# Altium project DriverBoard.PrjPCB
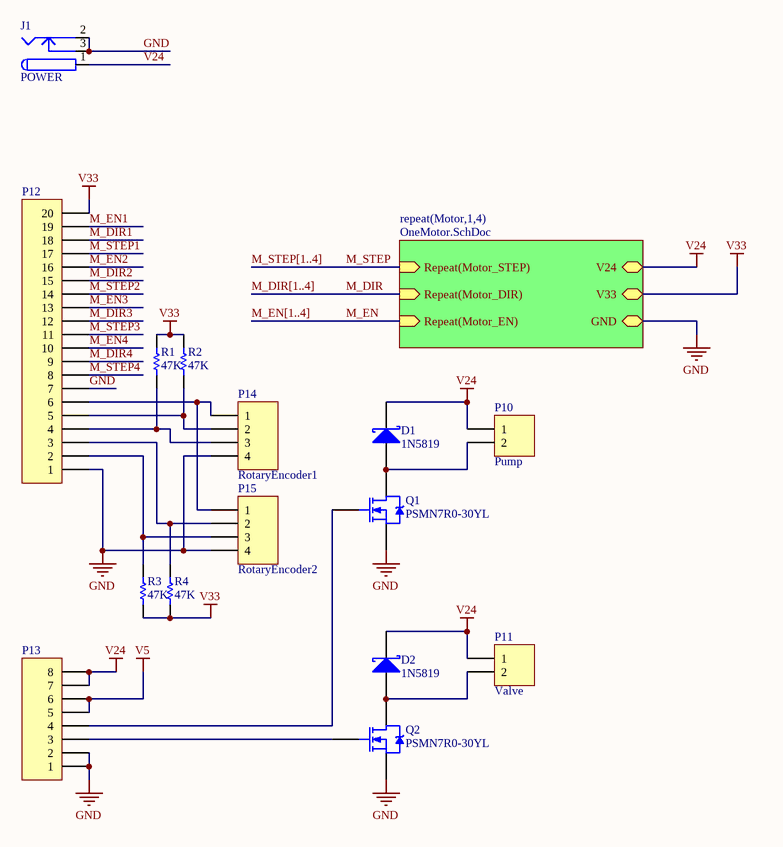
[diagram p0: DriverBoard.SchDoc]
2 sheets, 83 parts. Net scope: hierarchical (ports join the sheet entries above them; power ports are global).
Board file: DriverBoard.PcbDoc
Sheets:
  DriverBoard.SchDoc
    Motor1 = OneMotor.SchDoc
    Motor2 = OneMotor.SchDoc
    Motor3 = OneMotor.SchDoc
    Motor4 = OneMotor.SchDoc

## Sheet DriverBoard.SchDoc
size A4; Author: Zhang YuXiang; DrawnBy: Zhang YuXiang

### Parts
D1  1N5819  [DO-214AC]
D2  1N5819  [DO-214AC]
J1  POWER  [DC_POWER]
P10  Pump  [HDR1X2H]
P11  Valve  [HDR1X2H]
P12  Header 20  [HDR1X20]  (value not drawn)
P13  Header 8  [HDR1X8]  (value not drawn)
P14  RotaryEncoder1  [HDR1X4H]
P15  RotaryEncoder2  [HDR1X4H]
Q1  PSMN7R0-30YL  [SOT669]
Q2  PSMN7R0-30YL  [SOT669]
R1  value 47K  [R-1608[0603]]  (hidden comment: Res Semi)
R2  value 47K  [R-1608[0603]]  (hidden comment: Res Semi)
R3  value 47K  [R-1608[0603]]  (hidden comment: Res Semi)
R4  value 47K  [R-1608[0603]]  (hidden comment: Res Semi)

### Sub-sheets
repeat(Motor,1,4) = OneMotor.SchDoc: Repeat(Motor_STEP) (in), Repeat(Motor_DIR) (in), Repeat(Motor_EN) (in), V24, V33, GND

### Nets
GND: J1.2 J1.3 P12.1 P12.7 P13.1 P13.2 P14.4 P15.4 Q1.3(S) Q2.3(S) ; sheet repeat(Motor,1,4)/GND
V5: P13.5 P13.6
V24: D1.2(K) D2.2(K) J1.1 P10.1 P11.1 P13.7 P13.8 ; sheet repeat(Motor,1,4)/V24
V33: P12.20 R1.2 R2.2 R3.1 R4.1 ; sheet repeat(Motor,1,4)/V33
M_DIR: sheet repeat(Motor,1,4)/Repeat(Motor_DIR)
M_DIR1: P12.18  [project net FR]
M_DIR2: P12.15  [project net FR]
M_DIR3: P12.12  [project net FR]
M_DIR4: P12.9  [project net FR]
M_EN: sheet repeat(Motor,1,4)/Repeat(Motor_EN)
M_EN1: P12.19  [project net EN]
M_EN2: P12.16  [project net EN]
M_EN3: P12.13  [project net EN]
M_EN4: P12.10  [project net EN]
M_STEP: sheet repeat(Motor,1,4)/Repeat(Motor_STEP)
M_STEP1: P12.17
M_STEP2: P12.14
M_STEP3: P12.11
M_STEP4: P12.8
NetD1_1: D1.1(A) P10.2 Q1.2(D)
NetD2_1: D2.1(A) P11.2 Q2.2(D)
NetP12_2: P12.2 P15.3 R3.2
NetP12_3: P12.3 P15.2 R4.2
NetP12_4: P12.4 P14.3 R1.1
NetP12_5: P12.5 P14.2 R2.1
NetP12_6: P12.6 P14.1 P15.1
NetP13_3: P13.3 Q2.1(G)
NetP13_4: P13.4 Q1.1(G)

### Buses and harness runs
bus M_DIR[1..4]
bus M_EN[1..4]
bus M_STEP[1..4]

### Library data of the parts
D1 D2 = D Schottky: Schottky Diode; Published: 8-Jun-2000; LatestRevisionDate: 17-Jul-2002; LatestRevisionNote: Re-released for DXP Platform.; PackageReference: SMB; Publisher: Altium Limited; Code_JEDEC: DO-214-AA
J1 = POWER2.5
P10 P11 = Header 2H: Header, 2-Pin, Right Angle; LatestRevisionDate: 17-Jul-2002; LatestRevisionNote: Re-released for DXP Platform.; Publisher: Altium Limited
P12 = Header 20: Header, 20-Pin; LatestRevisionDate: 17-Jul-2002; LatestRevisionNote: Re-released for DXP Platform.; Publisher: Altium Limited
P13 = Header 8: Header, 8-Pin; LatestRevisionDate: 17-Jul-2002; LatestRevisionNote: Re-released for DXP Platform.; Publisher: Altium Limited
P14 P15 = Header 4H: Header, 4-Pin, Right Angle; LatestRevisionDate: 17-Jul-2002; LatestRevisionNote: Re-released for DXP Platform.; Publisher: Altium Limited
Q1 Q2 = NMOS-2: N-Channel Power MOSFET; Note: Pin 2 is electrically connected to pin 4.; Published: 8-Jun-2000; LatestRevisionDate: 17-Jul-2002; LatestRevisionNote: Re-released for DXP Platform.; DatasheetDocument: PD-9.814; PackageReference: TO-220AB; Publisher: Altium Limited; Code_JEDEC: TO-220-AB; ComponentLink1Description: Manufacturer Link; ComponentLink1URL: http://www.irf.com/
R1-R4 = Res Semi: Semiconductor Resistor; Published: 8-Jun-2000; LatestRevisionDate: 17-Jul-2002; LatestRevisionNote: Re-released for DXP Platform.; PackageReference: AXIAL-0.5; Publisher: Altium Limited

## Sheet OneMotor.SchDoc
size A4; Author: Zhang YuXiang; DrawnBy: Zhang YuXiang; Engineer: Zhang YuXiang
Used 4 times, as channels Motor1, Motor2, Motor3, Motor4. Parts and nets are listed once, with the designators drawn on the sheet.
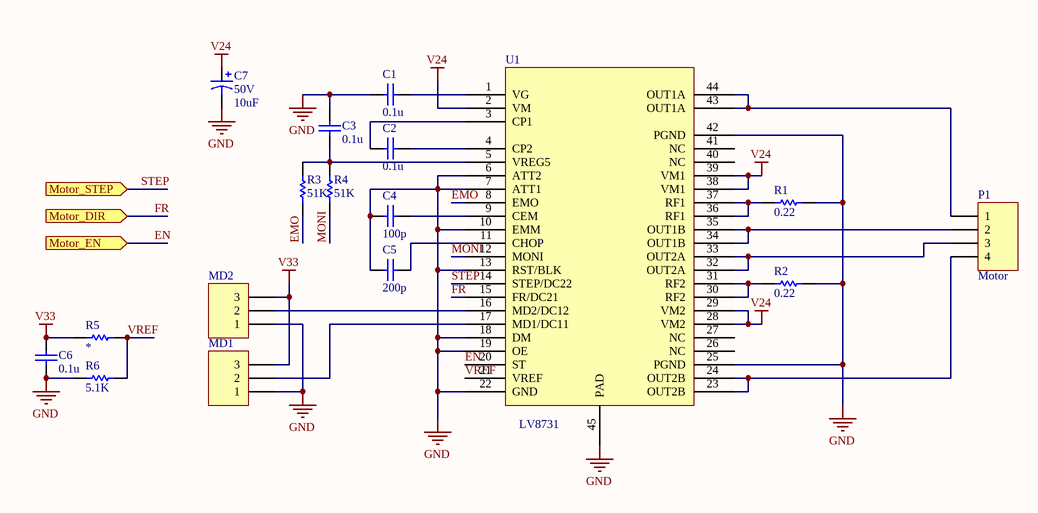
[diagram p1: OneMotor.SchDoc]

### Parts
C1  value 0.1u  [C-1608[0603]]  (hidden comment: Cap Semi)
C2  value 0.1u  [C-1608[0603]]  (hidden comment: Cap Semi)
C3  value 0.1u  [C-1608[0603]]  (hidden comment: Cap Semi)
C4  value 100p  [C-1608[0603]]  (hidden comment: Cap Semi)
C5  value 200p  [C-1608[0603]]  (hidden comment: Cap Semi)
C6  value 0.1u  [C-1608[0603]]  (hidden comment: Cap Semi)
C7  50V  value 10uF  [RB.1/.25]
MD1  Header 3  [shortPad]  (value not drawn)
MD2  Header 3  [shortPad]  (value not drawn)
P1  Motor  [HDR1X4]
R1  value 0.22  [R-6332[2512]]  (hidden comment: Res Semi)
R2  value 0.22  [R-6332[2512]]  (hidden comment: Res Semi)
R3  value 51K  [R-1608[0603]]  (hidden comment: Res Semi)
R4  value 51K  [R-1608[0603]]  (hidden comment: Res Semi)
R5  Res Semi  [R-1608[0603]]  (value not drawn)
R6  value 5.1K  [R-1608[0603]]  (hidden comment: Res Semi)
U1  LV8731  [LV8731_V3]

### Ports
Motor_DIR (in), Motor_EN (in), Motor_STEP (in)

### Nets
GND: C1.2 C3.1 C4.1 C5.1 C6.1 C7.2 MD1.1 MD2.1 R1.1 R2.1 R6.1 U1.6(ATT2) U1.7(ATT1) U1.10(EMM) U1.13(RST/BLK) U1.18(DM) U1.19(OE) U1.22(GND) U1.25(PGND) U1.42(PGND) U1.45(PAD)
V24: C7.1 U1.2(VM) U1.28(VM2) U1.29(VM2) U1.38(VM1) U1.39(VM1)
V33: C6.2 MD1.3 MD2.3 R5.1
EMO: R3.1 U1.8(EMO)
EN: U1.20(ST) ; port Motor_EN
FR: U1.15(FR/DC21) ; port Motor_DIR
MONI: R4.1 U1.12(MONI)
STEP: U1.14(STEP/DC22) ; port Motor_STEP
VREF: R5.2 R6.2 U1.21(VREF)
NetC1_1: C1.1 U1.1(VG)
NetC2_1: C2.1 U1.4(CP2)
NetC2_2: C2.2 U1.3(CP1)
NetC3_2: C3.2 R3.2 R4.2 U1.5(VREG5)
NetC4_2: C4.2 U1.9(CEM)
NetC5_2: C5.2 U1.11(CHOP)
NetMD1_2: MD1.2 U1.17(MD1/DC11)
NetMD2_2: MD2.2 U1.16(MD2/DC12)
NetP1_1: P1.1 U1.43(OUT1A) U1.44(OUT1A)
NetP1_2: P1.2 U1.34(OUT1B) U1.35(OUT1B)
NetP1_3: P1.3 U1.32(OUT2A) U1.33(OUT2A)
NetP1_4: P1.4 U1.23(OUT2B) U1.24(OUT2B)
NetR1_2: R1.2 U1.36(RF1) U1.37(RF1)
NetR2_2: R2.2 U1.30(RF2) U1.31(RF2)

Not connected (* = marked no-connect by the designer): U1 26(NC) 27(NC) 40(NC) 41(NC)

### Channels
Motor1: designators end in _1; ports Motor_DIR=FR Motor_EN=EN Motor_STEP=M_STEP1
Motor2: designators end in _2; ports Motor_DIR=FR Motor_EN=EN Motor_STEP=M_STEP2
Motor3: designators end in _3; ports Motor_DIR=FR Motor_EN=EN Motor_STEP=M_STEP3
Motor4: designators end in _4; ports Motor_DIR=FR Motor_EN=EN Motor_STEP=M_STEP4

### Library data of the parts
C1-C6 = Cap Semi: Capacitor (Semiconductor SIM Model); Published: 8-Jun-2000; LatestRevisionDate: 17-Jul-2002; LatestRevisionNote: Re-released for DXP Platform.; PackageReference: C1206; Publisher: Altium Limited
C7 = Cap Pol1: Polarized Capacitor (Radial); Published: 8-Jun-2000; LatestRevisionDate: 17-Jul-2002; LatestRevisionNote: Re-released for DXP Platform.; PackageReference: RB7.6-15; Publisher: Altium Limited
MD1 MD2 = Header 3: Header, 3-Pin; LatestRevisionDate: 17-Jul-2002; LatestRevisionNote: Re-released for DXP Platform.; Publisher: Altium Limited
P1 = Header 4: Header, 4-Pin; LatestRevisionDate: 17-Jul-2002; LatestRevisionNote: Re-released for DXP Platform.; Publisher: Altium Limited
R1-R6 = Res Semi: Semiconductor Resistor; Published: 8-Jun-2000; LatestRevisionDate: 17-Jul-2002; LatestRevisionNote: Re-released for DXP Platform.; PackageReference: AXIAL-0.5; Publisher: Altium Limited
  R5: Value: *

## Nets that join several sheets
GND: DriverBoard (10 pins), Motor1 (21 pins), Motor2 (21 pins), Motor3 (21 pins), Motor4 (21 pins)
V24: DriverBoard (7 pins), Motor1 (6 pins), Motor2 (6 pins), Motor3 (6 pins), Motor4 (6 pins)
V33: DriverBoard (5 pins), Motor1 (C6_1.2 MD1_1.3 MD2_1.3 R5_1.1), Motor2 (C6_2.2 MD1_2.3 MD2_2.3 R5_2.1), Motor3 (C6_3.2 MD1_3.3 MD2_3.3 R5_3.1), Motor4 (C6_4.2 MD1_4.3 MD2_4.3 R5_4.1)
EN: DriverBoard (P12.10), Motor4 (U1_4.20)
EN: DriverBoard (P12.13), Motor3 (U1_3.20)
EN: DriverBoard (P12.16), Motor2 (U1_2.20)
EN: DriverBoard (P12.19), Motor1 (U1_1.20)
FR: DriverBoard (P12.9), Motor4 (U1_4.15)
FR: DriverBoard (P12.12), Motor3 (U1_3.15)
FR: DriverBoard (P12.15), Motor2 (U1_2.15)
FR: DriverBoard (P12.18), Motor1 (U1_1.15)
M_STEP1: DriverBoard (P12.17), Motor1 (U1_1.14)
M_STEP2: DriverBoard (P12.14), Motor2 (U1_2.14)
M_STEP3: DriverBoard (P12.11), Motor3 (U1_3.14)
M_STEP4: DriverBoard (P12.8), Motor4 (U1_4.14)